# Altium schematic sheet CPU.SchDoc
size A4
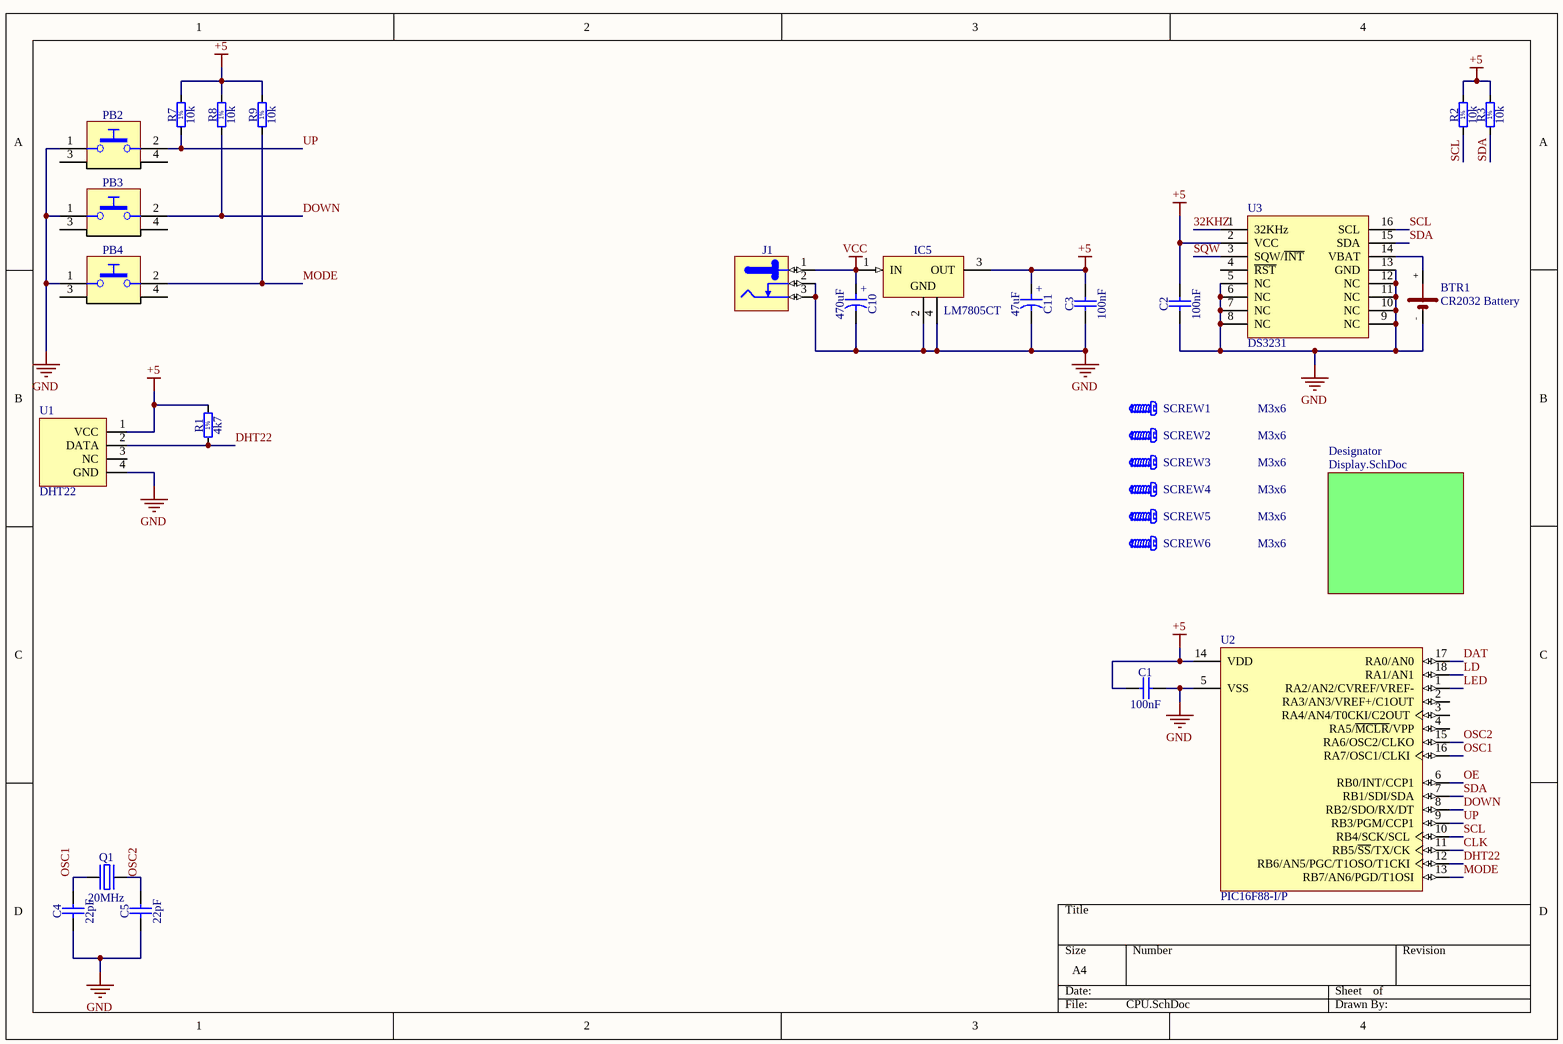
[diagram p0: CPU.SchDoc]

## Parts
BTR1  CR2032 Battery  [cr1220]
C1  100nF  [CAPRR508-350X500X500]
C2  100nF  [CAPRR508-350X500X500]
C3  100nF  [CAPRR508-350X500X500]
C4  22pF  [CAPRR254-254X381X381]
C5  22pF  [CAPRR254-254X381X381]
C10  470uF  [CAPPR350-850X1300]
C11  47uF  [CAPPR250-500X1100]
IC5  LM7805CT  [TO-220-H]
J1  Jack  [CLIFF_FC68148(DC-10A)]  (value not drawn)
PB2  Push Button  [PB_TYCO_1-1825027-1]  (value not drawn)
PB3  Push Button  [PB_TYCO_1-1825027-1]  (value not drawn)
PB4  Push Button  [PB_TYCO_1-1825027-1]  (value not drawn)
Q1  20MHz  [XTAL_HC-49/U]
R1  4k7  [RES1016-630X250]
R2  10k  [RES1016-630X250]
R3  10k  [RES1016-630X250]
R7  10k  [RES1016-630X250]
R8  10k  [RES1016-630X250]
R9  10k  [RES1016-630X250]
SCREW1  M3x6  [BOSSARD_BN5687-3061605_v]
SCREW2  M3x6  [BOSSARD_BN5687-3061605_v]
SCREW3  M3x6  [BOSSARD_BN5687-3061605_v]
SCREW4  M3x6  [BOSSARD_BN5687-3061605_v]
SCREW5  M3x6  [BOSSARD_BN5687-3061605_v]
SCREW6  M3x6  [BOSSARD_BN5687-3061605_v]
U1  DHT22  [DHT22_HOR]
U2  PIC16F88-I/P  [PDIP300-P18]
U3  DS3231  [SOIC16W]

## Sub-sheets
Designator = Display.SchDoc: no entries

## Nets
+5: C1.1 C2.2 C3.2 C11.1 IC5.3(OUT) R1.2 R2.2 R3.2 R7.2 R8.2 R9.2 U1.1(VCC) U2.14(VDD) U3.2(VCC)
GND: BTR1.- C1.2 C2.1 C3.1 C4.1 C5.1 C10.2 C11.2 IC5.2(GND) IC5.4(GND) J1.2 J1.3 PB2.1 PB3.1 PB4.1 U1.4(GND) U2.5(VSS) U3.5(NC) U3.6(NC) U3.7(NC) U3.8(NC) U3.9(NC) U3.10(NC) U3.11(NC) U3.12(NC) U3.13(GND)
VCC: C10.1 IC5.1(IN) J1.1
32KHZ: U3.1(32KHz)
CLK: U2.11(RB5/~{SS}/TX/CK)
DAT: U2.17(RA0/AN0)
DHT22: R1.1 U1.2(DATA) U2.12(RB6/AN5/PGC/T1OSO/T1CKI)
DOWN: PB3.2 R8.1 U2.8(RB2/SDO/RX/DT)
LD: U2.18(RA1/AN1)
LED: U2.1(RA2/AN2/CVREF/VREF-)
MODE: PB4.2 R9.1 U2.13(RB7/AN6/PGD/T1OSI)
OE: U2.6(RB0/INT/CCP1)
OSC1: C4.2 Q1.1(OSC1) U2.16(RA7/OSC1/CLKI)
OSC2: C5.2 Q1.2(OSC2) U2.15(RA6/OSC2/CLKO)
SCL: R2.1 U2.10(RB4/SCK/SCL) U3.16(SCL)
SDA: R3.1 U2.7(RB1/SDI/SDA) U3.15(SDA)
SQW: U3.3(SQW/~{INT})
UP: PB2.2 R7.1 U2.9(RB3/PGM/CCP1)
NetBTR1_+: BTR1.+ U3.14(VBAT)

Not connected (* = marked no-connect by the designer): PB2 3 4; PB3 3 4; PB4 3 4; U1 3(NC); U2 2(RA3/AN3/VREF+/C1OUT) 3(RA4/AN4/T0CKI/C2OUT) 4(RA5/~{MCLR}/VPP); U3 4(~{RST})

## Notes on the sheet
- (in symbol CAER_47UF_25V_20%_250-500X1100) +
- (in symbol CAER_470UF_16V_20%_LESR0R056_PANASONIC_FR-A) +
- (in symbol RMF_4K7_1%_0.6W_50PPM_1016-630X250) 1%
- (in symbol RMF_10K_1%_0.6W_50PPM_1016-630X250) 1%

## Library data of the parts
BTR1 = CR2032: pin to pad: +>1 ->2
C1-C3 = CCR_100NF_50V_10%_X7R_508-350X500X500: Non-polarised capacitor; Part Description: Radial Lead Type Monolithic Ceramic Capacitor; Manufacturer: MURATA; Manufacturer Part Number: RPER71H104K2M1A03A; Status Comment: Can be replaced by KEMET C322C104K5R5TA; Voltage: 50VDC; TC: X7R; Tolerance: ±10%; Part Number: CCR_100NF_50V_10%_X7R_508-350X500X500; Component Kind: Standard; Component Type: Standard; Pin Count: 2; Value: 100nF; Status: Obsolete; Case: LS5.08 W3.5 x L5 x H5; Mounted: Yes; Socket: No; SMD: No; Sense: No; ComponentHeight: 5.0mm; HelpURL: \\cern.ch\dfs\Applications\Altium\Datasheets\CCR_MURATA_RPE.pdf; Author: CERN DEM JLC; CreateDate: 28.01.2008; LatestRevisionDate: 3.08.2016
C4 C5 = CCR_22PF_100V_5%_C0G_254-254X381X381: Non-polarised capacitor; Part Description: Radial Lead Type Multilayer Ceramic Capacitor; Manufacturer: AVX; Manufacturer Part Number: SR151A220JAA; Voltage: 100V; TC: C0G; Tolerance: ±5%; Part Number: CCR_22PF_100V_5%_C0G_254-254X381X381; Component Kind: Standard; Component Type: Standard; Pin Count: 2; Value: 22pF; Status: None; Case: LS2.54 W2.54 x L3.81 x H3.81; Mounted: Yes; Socket: No; SMD: No; Sense: No; ComponentHeight: 3.81mm; HelpURL: \\cern.ch\dfs\Applications\Altium\Datasheets\CCR_AVX_SR15.pdf; Author: CERN DEM JLC; CreateDate: 16.04.2015; LatestRevisionDate: 16.04.2015
C10 = CAER_470UF_16V_20%_LESR0R056_PANASONIC_FR-A: Polarised capacitor; Part Description: Low ESR 0R056, Radial Lead, Aluminum Electrolytic Capacitor, (FR Series, Type A); Manufacturer Part Number: EEUFR1C471; Voltage: 16V; Tolerance: ±20%; Part Number: CAER_470UF_16V_20%_LESR0R056_PANASONIC_FR-A; Component Kind: Standard; Component Type: Standard; Pin Count: 2; Value: 470uF; Status: None; Manufacturer: PANASONIC; Case: LS3.5 D8.5 x H13; Mounted: Yes; Socket: No; SMD: No; Sense: No; ComponentHeight: 13mm; HelpURL: \\cern.ch\dfs\Applications\Altium\Datasheets\CAER_PANASONIC_FR-A.pdf; Author: CERN DEM JLC; CreateDate: 15.06.2010; LatestRevisionDate: 15.06.2010
C11 = CAER_47UF_25V_20%_250-500X1100: Polarised capacitor; Part Description: Aluminum Electrolytic Capacitor; Manufacturer: GENERIC; Manufacturer1 Part Number: EEUFC1E470; Voltage: 25V; Tolerance: ±20%; Part Number: CAER_47UF_25V_20%_250-500X1100; Component Kind: Standard; Component Type: Standard; Pin Count: 2; Value: 47uF; Status: Preferred; Manufacturer Part Number: CAER_47UF_25V_20%_250-500X1100; Case: LS2.5 D5 x H11; Mounted: Yes; Socket: No; SMD: No; Sense: No; ComponentHeight: 11mm; Manufacturer1 Example: PANASONIC; Manufacturer1 ComponentHeight: 11mm; HelpURL: \\cern.ch\dfs\Applications\Altium\Datasheets\CAER_PANASONIC_FC.pdf; Author: CERN DEM JLC; CreateDate: 18.12.2007; LatestRevisionDate: 18.12.2007
IC5 = LM7805CT_h: 3-Terminal Regulator 1=IN 2=GND 3=OUT 4=GND; Part Description: 3-Terminal 5V 1A Positive Voltage Regulator; Manufacturer: FAIRCHILD SEMICONDUCTOR; PressFit: No; Bonding: No; Part Number: LM7805CT_h; Component Kind: Standard; Component Type: Standard; Device: LM7805CT; PackageDescription: TO-220 3-Terminal + Tab - Horizontal Mount; Manufacturer Part Number: LM7805CT; Pin Count: 4; Case: TO-220; Mounted: Yes; Socket: No; SMD: No; Sense: No; ComponentHeight: 4.7mm; HelpURL: \\cern.ch\dfs\Applications\Altium\Datasheets\LM7805CT.pdf; Author: CERN DEM JLC; CreateDate: 18.03.2008; LatestRevisionDate: 18.03.2008
J1 = CLIFF_FC68148(DC-10A): 12V /  5A, 2.1mm Diameter Pin, DC Power Socket With  Switch. DC10A Type; Part Description: 12V/5A, 2.1mm Diameter Pin, DC Power Socket With  Switch (DC10A Type); Manufacturer: CLIFF ELECTRONIC COMPONENTS; PressFit: No; Part Number: CLIFF_FC68148(DC-10A); Component Kind: Standard; Component Type: Standard; Pin Count: 3; Family: Jack; Mounted: Yes; Socket: No; SMD: No; Sense: No; Status: None; Manufacturer Part Number: FC68148 (DC-10A); ComponentHeight: 11mm; HelpURL: \\cern.ch\dfs\Applications\Altium\Datasheets\CLIFF_FC68148(DC-10A).pdf; Author: CERN DEM JLC; CreateDate: 23.11.2010; LatestRevisionDate: 23.11.2010
PB2-PB4 = PB_TYCO_1-1825027-1: Push-Button Switch SPDT; Part Description: Right Angle Micro Miniature Tactile Pushbutton Switch, Round Actuator Length = 5.74mm, FSMRAJ Series; Manufacturer: TYCO ELECTRONICS; PressFit: No; Part Number: PB_TYCO_1-1825027-1; Component Kind: Standard; Component Type: Standard; Pin Count: 4; PackageDescription: Right Angle Micro Miniature Tactile Pushbutton Switch, Round Actuator Length = 5.74mm, FSMRAJ Serie; Family: Push Button; Mounted: Yes; Socket: No; SMD: No; Sense: No; Status: None; Manufacturer Part Number: 1-1825027-1; ComponentHeight: 7.01mm; HelpURL: \\cern.ch\dfs\Applications\Altium\Datasheets\PB_TYCO_1-1825027-1.pdf; Author: CERN DEM JLC; CreateDate: 17.04.2013; LatestRevisionDate: 28.10.2013
Q1 = XTAL_20MHZ_AEL_HC-49/U: Quartz Crystal; Part Description: ±30ppm Quartz Crystal Resonator, HC-49/U Type; Manufacturer: AEL CRYSTALS; Manufacturer Part Number: X20M000000L010; PressFit: No; Bonding: No; Part Number: XTAL_20MHZ_AEL_HC-49/U; Component Kind: Standard; Component Type: Standard; PackageDescription: HC-49/U Leaded Cristal, Body 11.05x4.8mm; Pitch 4.88mm; Value: 20MHz; Pin Count: 2; Mounted: Yes; Socket: No; SMD: No; Sense: No; ComponentHeight: 13.6mm; HelpURL: \\cern.ch\dfs\Applications\Altium\Datasheets\XTAL_AEL_HC-49-U.pdf; Author: CERN DEM JMW; CreateDate: 31.10.2008; LatestRevisionDate: 13.05.2011
R1 = RMF_4K7_1%_0.6W_50PPM_1016-630X250: Resistor - 1%; Part Description: Leaded Metal Film Resistor; Manufacturer: GENERIC; Manufacturer1 Part Number: MBB02070C4701FCT00; Power: 0.6W; TC: ±50ppm/°C; PressFit: No; Part Number: RMF_4K7_1%_0.6W_50PPM_1016-630X250; Component Kind: Standard; Component Type: Standard; Pin Count: 2; Value: 4k7; Status: Preferred; Tolerance: ±1%; Manufacturer Part Number: RMF_4K7_1%_0.6W_50PPM_1016-630X250; Case: LS10.16 L6.3 x D2.5; Mounted: Yes; Sense: No; Socket: No; SMD: No; ComponentHeight: 2.5mm; Manufacturer1 Example: VISHAY BEYSCHLAG; Manufacturer1 ComponentHeight: 2.5mm; HelpURL: \\cern.ch\dfs\Applications\Altium\Datasheets\RMF_VISHAY_MBB0207.pdf; Author: CERN DEM JLC; CreateDate: 4.12.2007; LatestRevisionDate: 7.04.2008
R2 R3 R7-R9 = RMF_10K_1%_0.6W_50PPM_1016-630X250: Resistor - 1%; Part Description: Leaded Metal Film Resistor; Manufacturer: GENERIC; Manufacturer1 Part Number: MBB02070C1002FCT00; Power: 0.6W; TC: ±50ppm/°C; PressFit: No; Part Number: RMF_10K_1%_0.6W_50PPM_1016-630X250; Component Kind: Standard; Component Type: Standard; Pin Count: 2; Value: 10k; Status: Preferred; Tolerance: ±1%; Manufacturer Part Number: RMF_10K_1%_0.6W_50PPM_1016-630X250; Case: LS10.16 L6.3 x D2.5; Mounted: Yes; Sense: No; Socket: No; SMD: No; ComponentHeight: 2.5mm; Manufacturer1 Example: VISHAY BEYSCHLAG; Manufacturer1 ComponentHeight: 2.5mm; HelpURL: \\cern.ch\dfs\Applications\Altium\Datasheets\RMF_VISHAY_MBB0207.pdf; Author: CERN DEM JLC; CreateDate: 4.12.2007; LatestRevisionDate: 7.04.2008
SCREW1-SCREW6 = BOSSARD_BN5687-3061605_v: Screw; Part Description: M3 L=6mm Hexalobular Socket Pan Head Screw, Fully Threaded, Stainless Steel A2; Manufacturer Part Number: BN5687 Art.3061605; PressFit: No; Part Number: BOSSARD_BN5687-3061605_v; Component Kind: Standard; Component Type: Mechanical; Pin Count: 0; PackageDescription: M3 L=6mm Hexalobular Socket Pan Head Screw, Fully Threaded - Stainless Steel A2; Mounted: Yes; Socket: No; SMD: No; Sense: No; Status: None; Value: M3x6; Manufacturer: BOSSARD; ComponentHeight: 2.4mm; HelpURL: \\cern.ch\dfs\Applications\Altium\Datasheets\BOSSARD_BN5687-3061605.pdf; Author: CERN DEM JLC; CreateDate: 15.01.2013; LatestRevisionDate: 15.01.2013
U2 = PIC16F88-I/P: Enhanced FLASH Microcontroller with nanoWatt Technology, 10-Bit A/D, 4K (x14-Bit words) FLASH, 368 Bytes RAM, 18-Pin PDIP, Standard VDD Range, Industrial Temperature; Note: The CCP1 pin is determined by CCPMX in Configuration Word 1 register.; Published: 11-Oct-2004; LatestRevisionDate: 29-Jan-2009; LatestRevisionNote: Sch. layout revised. 3D Model Removed.; DatasheetVersion: revC, Jan-2005; PackageVersion: revBB, Aug-2009; PackageReference: PDIP300-P18; Publisher: Altium Limited; PackageDescription: 18-Lead Plastic Dual In-Line (P) - 300 mil Body [PDIP]; Supplier 1: Digi-Key; Supplier Part Number 1: PIC16F88-I/P-ND; Supplier 2: Farnell; Supplier Part Number 2: 1523967; Supplier 3: Farnell; Supplier Part Number 3: 9761500; Code_JEDEC: MS-001; ComponentLink1Description: Datasheet; ComponentLink1URL: http://ww1.microchip.com/downloads/en/DeviceDoc/30487c.pdf; ComponentLink2Description: Packaging Specification; ComponentLink2URL: http://www.microchip.com/stellent/groups/techpub_sg/documents/packagingspec/en012702.pdf; ComponentLink3Description: Microchip.com Home; ComponentLink3URL: http://www.microchip.com/